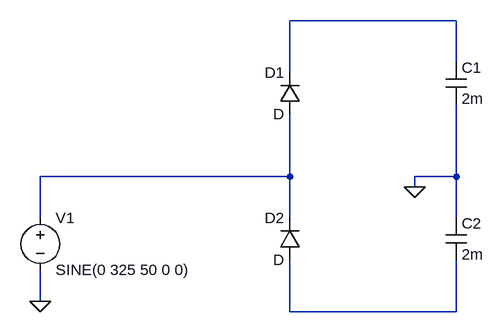
[diagram p0: schematic Draft1.asc]
Draft1.asc, the LTspice schematic file:
Version 4
SHEET 1 880 680
WIRE 416 0 160 0
WIRE 416 64 416 0
WIRE 160 80 160 0
WIRE 160 240 160 144
WIRE 160 240 -224 240
WIRE 416 240 416 128
WIRE 416 240 352 240
WIRE 352 256 352 240
WIRE -224 304 -224 240
WIRE 160 304 160 240
WIRE 416 304 416 240
WIRE -224 432 -224 384
WIRE 160 448 160 368
WIRE 416 448 416 368
WIRE 416 448 160 448
FLAG 352 256 0
FLAG -224 432 0
SYMBOL diode 176 144 R180
WINDOW 0 24 64 Left 2
WINDOW 3 24 0 Left 2
SYMATTR InstName D1
SYMBOL diode 176 368 R180
WINDOW 0 24 64 Left 2
WINDOW 3 24 0 Left 2
SYMATTR InstName D2
SYMBOL voltage -224 288 R0
WINDOW 123 0 0 Left 0
WINDOW 39 0 0 Left 0
SYMATTR InstName V1
SYMATTR Value SINE(0 325 50 0 0)
SYMBOL cap 400 64 R0
SYMATTR InstName C1
SYMATTR Value 2m
SYMBOL cap 400 304 R0
SYMATTR InstName C2
SYMATTR Value 2m

The netlist it stands for:
* Draft1.asc
D1 N002 N001 D
D2 N003 N002 D
V1 N002 0 SINE(0 325 50 0 0)
C1 N001 0 2m
C2 0 N003 2m
.model D D
.lib standard.dio
.backanno
.end